# Altium schematic sheet B302 PI Coil Driver.SchDoc
size A4
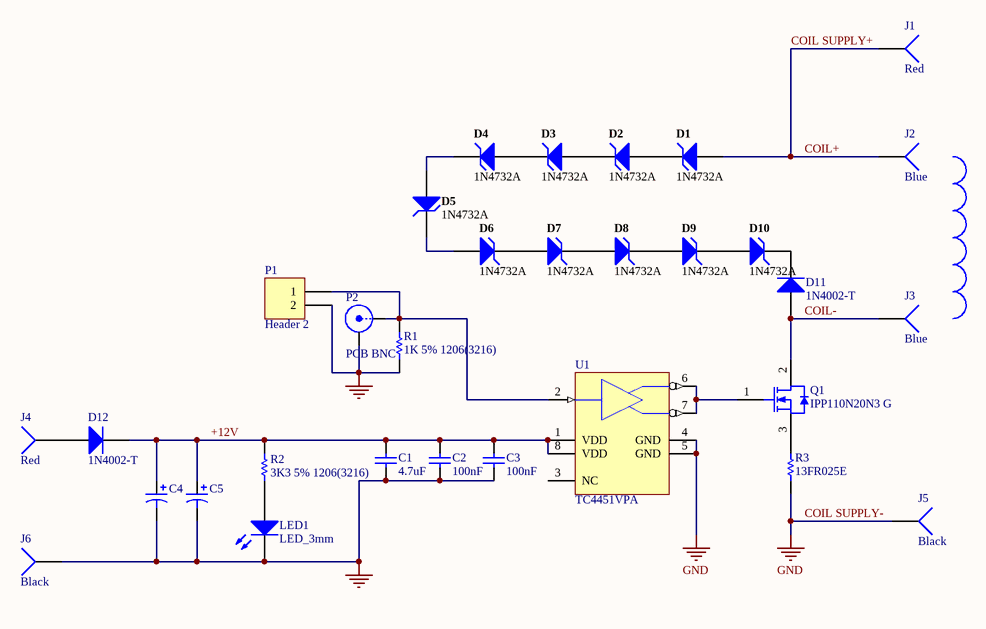
[diagram p0: B302 PI Coil Driver.SchDoc]

## Parts
C1  4.7uF  [CAPC1206(3216)190_N]
C2  100nF  [CAPC1206(3216)150_M]
C3  100nF  [CAPC1206(3216)150_M]
C4  Cap Polarised  [CAPPR5-10X12.5]  (value not drawn)
C5  ECA-1HM470  [PNSC-ECA-1HM470]  (value not drawn)
D1  1N4732A  [FAIR-DO-41-2_V]
D2  1N4732A  [FAIR-DO-41-2_V]
D3  1N4732A  [FAIR-DO-41-2_V]
D4  1N4732A  [FAIR-DO-41-2_V]
D5  1N4732A  [FAIR-DO-41-2_V]
D6  1N4732A  [FAIR-DO-41-2_V]
D7  1N4732A  [FAIR-DO-41-2_V]
D8  1N4732A  [FAIR-DO-41-2_V]
D9  1N4732A  [FAIR-DO-41-2_V]
D10  1N4732A  [FAIR-DO-41-2_V]
D11  1N4002-T  [DIOD-DO-41-P-2_V]
D12  1N4002-T  [DIOD-DO-41-P-2_V]
J1  Red  [4mm socket right angled]
J2  Blue  [4mm socket right angled]
J3  Blue  [4mm socket right angled]
J4  Red  [4mm socket right angled]
J5  Black  [4mm socket right angled]
J6  Black  [4mm socket right angled]
LED1  LED_3mm  [LED-Polarized - 3mm]
P1  Header 2  [HDR1X2]
P2  PCB BNC  [PCB BNC RA Socket]
Q1  IPP110N20N3 G  [INF-PG-TO220-3-1_A_V]
R1  1K 5% 1206(3216)  [RESC1206(3216)_N]
R2  3K3 5% 1206(3216)  [RESC1206(3216)_N]
R3  13FR025E  [OMTE-13FR025E]
U1  TC4451VPA  [PDIP300-PA8]

## Nets
COIL SUPPLY-: C1.2 C2.2 C3.2 C4.2 C5.2(-) J5.1 J6.1 LED1.K P1.2 P2.2(Y) R1.1 R3.1 U1.4(GND) U1.5(GND)  [also labelled GND]
+12V: C1.1 C2.1 C3.1 C4.1 C5.1(+) D12.2(K) R2.2 U1.1(VDD) U1.8(VDD)
COIL SUPPLY+: D1.1(A) J1.1 J2.1  [also labelled COIL+]
COIL-: D11.1(A) J3.1 Q1.2(DRAIN)
NetD1_2: D1.2(K) D2.1(A)
NetD2_2: D2.2(K) D3.1(A)
NetD3_2: D3.2(K) D4.1(A)
NetD4_2: D4.2(K) D5.1(A)
NetD5_2: D5.2(K) D6.1(A)
NetD6_2: D6.2(K) D7.1(A)
NetD7_2: D7.2(K) D8.1(A)
NetD8_2: D8.2(K) D9.1(A)
NetD9_2: D9.2(K) D10.1(A)
NetD10_2: D10.2(K) D11.2(K)
NetD12_1: D12.1(A) J4.1
NetLED1_A: LED1.A R2.1
NetP1_1: P1.1 P2.1(X) R1.2 U1.2(IN)
NetQ1_1: Q1.1(GATE) U1.6(~{OUT}) U1.7(~{OUT})
NetQ1_3: Q1.3(SOURCE) R3.2

Not connected (* = marked no-connect by the designer): U1 3(NC)

## Library data of the parts
C1 = CMP-1037-04923-1: CAP 4.7uF 50V ±10% 1206 (3216 Metric) Thickness 1.9mm SMD; Case-EIA: 1206; Case-Metric: 3216; Tolerance: Â±10%; Technology: SMT; Rated Voltage: 50 V; Max Thickness: 1.9 mm; Value: 4.7uF
C2 C3 = CMP-1037-04216-1: CAP 100nF 100V ±20% 1206 (3216 Metric) Thickness 1.45mm SMD; Case-Metric: 3216; Case-EIA: 1206; Tolerance: Â±20%; Max Thickness: 1.45 mm; Technology: SMT; Value: 100nF; Rated Voltage: 100 V
C5 = CMP-1665-00013-1: CAP ALUM 47UF 50V 20% RADIAL; PartNumber: ECA-1HM470; PackageReference: ECA-1HM470; ComponentLink1Description: Datasheet; ComponentLink1URL: http://industrial.panasonic.com/cdbs/www-data/pdf/RDF0000/ABA0000C1047.pdf
D1-D10 = CMP-0892-00030-1: Zener Diode, 4.7V, 1W, 5%, -65 to 200 degC, 2-Pin DO-41, Body 2.72 x 5.2 mm, RoHS; Manufacturer: Fairchild Semiconductor; VZ (Min.) (V): 4.465; ZZ (Max) (ohm): 8; VZ (Max.) (V): 4.935; PD (W): 1; IR (uA): 10; Test Current IZ (mA): 53; DatasheetVersion: Rev. H3; ComponentLink3Description: Package Specification; PartNumber: 1N4732A; PackageReference: DO-41-2; PackageVersion: Rev. 2; ComponentLink1Description: Manufacturer URL; Operating and Storage Temperature Range: -65 to 200 degC; PackageDescription: 2-Pin Axial leaded, Body 2.72 x 5.2 mm, Lead Spread 25.4 mm; ComponentLink2URL: http://www.fairchildsemi.com/ds/1N/1N4744A.pdf; Tolerance: 5%; ComponentLink2Description: Datasheet; Mounting Technology: Through Hole; RoHS: TRUE; ComponentLink3URL: http://www.fairchildsemi.com/dwg/DO/DO41A.pdf; ComponentLink1URL: http://www.fairchildsemi.com/
D11 D12 = CMP-0639-00002-2: 1.0 A Rectifier, 15 pF, 100 V, -65 to 150 degC, 2-Pin DO-41 Plastic, RoHS, Tape and Reel; Manufacturer: Diodes Inc; Max. Average Rectified Current IO (A): 1; Max. IFSM (A): 30; CT (pF): 15; Max. IR (uA): 5; VRRM (V): 100; DatasheetVersion: Rev. 8-2; ComponentLink2Description: Datasheet; PartNumber: 1N4002-T; ComponentLink2URL: http://diodes.com/datasheets/ds28002.pdf; PackageDescription: 2-Pin Axial Lead, Body 4.635 x 2.36 mm, Lead Spread 25.4 mm; ComponentLink1Description: Manufacturer URL; RoHS: TRUE; Mounting Technology: Through Hole; Packing: Tape and Reel; Operating Temperature Range (degC): -65 to 150; VF (V): 1; ComponentLink1URL: http://diodes.com/; PackageReference: DO-41-P-2
J1 J4 = 4mm pcb socket r/a red: Colour: Red; Supplier: Onecall; Supplier Part Number: 1101127
J2 J3 = 4mm pcb socket r/a blue: Supplier: Onecall; Supplier Part Number: 1101130
J5 J6 = 4mm pcb socket r/a black: Supplier: Onecall; Supplier Part Number: 1101128
LED1 = LED_3mm: 3mm LED; Published: 8-Jun-2000; LatestRevisionDate: 17-Jul-2002; LatestRevisionNote: Re-released for DXP Platform.; Publisher: Altium Limited
P1 = Header 2: Header, 2-Pin; LatestRevisionDate: 17-Jul-2002; LatestRevisionNote: Re-released for DXP Platform.; Publisher: Altium Limited
P2 = PCB BNC: PCB RA BNC Socket; Supplier: Onecall; Supplier Part Number: 1248952
Q1 = CMP-1091-00081-1: N-Channel OptiMOS 3 Power-Transistor, 200 V VDS, 88 A ID, -55 to 175 degC, PG-TO220-3-1, Tube, Green; Manufacturer: Infineon; Ptot (max): 300Â W; QG: 65Â nC; ID (max): 88Â A; RthJA (max): 62Â K/W; Rth: 0.5Â K/W; VGS(th) (max): 4Â V; IDpuls (max): 352Â A; Polarity: N; VDS (max): 200Â V; VGS(th) (min): 2Â V; Green: TRUE; RDS (on) (max): 11Â mOhm; ComponentLink3Description: Package Specification; ComponentLink2Description: Datasheet; Mounting Technology: Through Hole; ComponentLink1URL: http://www.infineon.com/; DatasheetVersion: Rev. 2.3; PartNumber: IPP110N20N3 G; ComponentLink3URL: http://www.infineon.com/dgdl/IPP028N08N3_Rev1%5B1%5D.0.pdf?folderId=db3a304313b8b5a60113cee8763b02d7&fileId=db3a30432313ff5e0123a3c08e7326b5; PackageReference: PG-TO220-3-1; Halogen-free: TRUE; ComponentLink1Description: Manufacturer URL; Packing: Tube; RthJC (max): 0.5Â K/W; ComponentLink2URL: http://www.infineon.com/dgdl/IPP_I_110N20N3+G_IPB107N20N3+G+Rev2.3.pdf?folderId=db3a3043163797a6011637d4bae7003b&fileId=db3a3043243b5f170124968e7d1f18e7; PackageVersion: Rev. 05, 08/2007; PackageDescription: 3-Pin Plastic (Green) Transistor Single Outline Package, 10.03 x 8.98 mm Body, 2.54 mm Pitch
R1 = CMP-1014-00074-1: 1K 0.25W 5% 1206 (3216 Metric)  SMD; Value: 1000.00 Ohm; Case-Metric: 3216; Case-EIA: 1206; Published: 8-Jun-2000; LatestRevisionDate: 17-Jul-2002; LatestRevisionNote: Re-released for DXP Platform.; Publisher: Altium Limited; Tolerance: 5 %; Power: 0.25 W; Technology: SMT
R2 = CMP-1014-00086-1: 3K3 0.25W 5% 1206 (3216 Metric)  SMD; Case-EIA: 1206; Case-Metric: 3216; Value: 3300.00 Ohm; Published: 8-Jun-2000; LatestRevisionDate: 17-Jul-2002; LatestRevisionNote: Re-released for DXP Platform.; Publisher: Altium Limited; Technology: SMT; Power: 0.25 W; Tolerance: 5 %
R3 = CMP-1678-00001-4: RES CURRENT SENSE .025 OHM 3W; Manufacturer: Ohmite; ComponentLink1URL: http://www.ohmite.com/cat/res_10.pdf; PackageReference: 13FR025E; ComponentLink1Description: Datasheet; PartNumber: 13FR025E
U1 = CMP-0137-00054-1: 12A High-Speed MOSFET Drivers, Inverting, Extended Temperature; PackageVersion: revBB, Aug-2009; DatasheetVersion: revA, Feb-2006; PackageReference: PDIP300-PA8; Code_JEDEC: MS-001-BA; PackageDescription: 8-Lead Plastic Dual In-Line (PA) - 300 mil Body [PDIP]